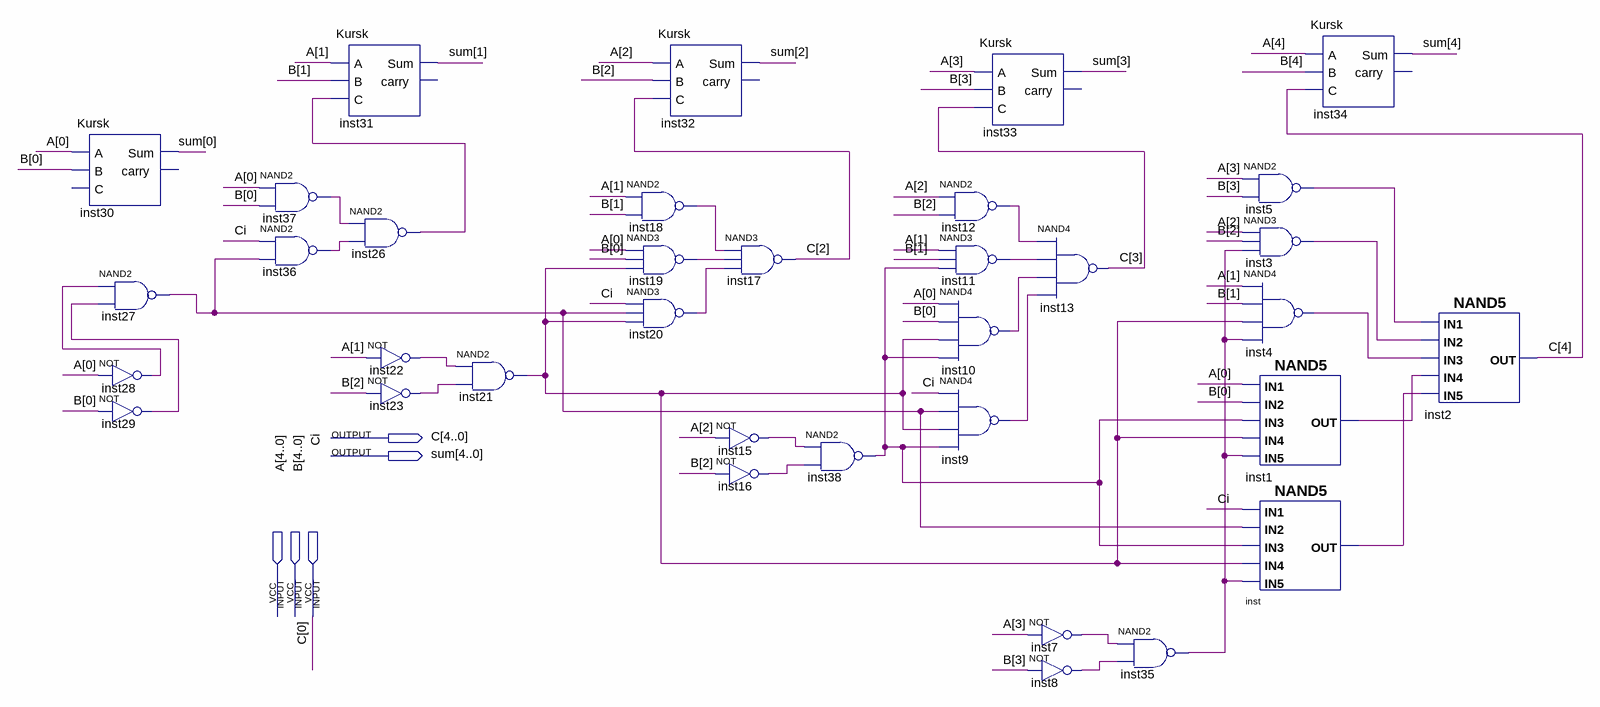
[diagram p0: schematic sheet]
// Quartus schematic paralelsum.bdf as structural Verilog: 35 symbols, 5 pins
module paralelsum (
  input  [4:0] A,
  input  [4:0] B,
  input  Ci,
  output [4:0] C,
  output [4:0] sum
);

  wire inst1_out, inst3_out, inst4_out, inst5_out, inst7_out, inst8_out, inst9_out, inst10_out, inst11_out,
       inst12_out, inst15_out, inst16_out, inst18_out, inst19_out, inst20_out, inst21_out, inst22_out,
       inst23_out, inst26_out, inst27_out, inst28_out, inst29_out, inst35_out, inst36_out, inst37_out,
       inst38_out, inst_out;

  Kursk inst30 (.A(A[0]), .B(B[0]), .Sum(sum[0]));  // open: C, carry
  nand inst27 (inst27_out, inst28_out, inst29_out);
  not inst28 (inst28_out, A[0]);
  not inst29 (inst29_out, B[0]);
  nand inst37 (inst37_out, A[0], B[0]);
  nand inst36 (inst36_out, Ci, inst27_out);
  Kursk inst31 (.A(A[1]), .B(B[1]), .C(inst26_out), .Sum(sum[1]));  // open: carry
  nand inst26 (inst26_out, inst37_out, inst36_out);
  not inst22 (inst22_out, A[1]);
  not inst23 (inst23_out, B[2]);
  nand inst21 (inst21_out, inst22_out, inst23_out);
  Kursk inst32 (.A(A[2]), .B(B[2]), .C(C[2]), .Sum(sum[2]));  // open: carry
  nand inst18 (inst18_out, A[1], B[1]);
  nand inst19 (inst19_out, A[0], B[0], inst21_out);
  nand inst20 (inst20_out, Ci, inst27_out, inst21_out);
  nand inst17 (C[2], inst18_out, inst19_out, inst20_out);
  not inst15 (inst15_out, A[2]);
  not inst16 (inst16_out, B[2]);
  nand inst38 (inst38_out, inst15_out, inst16_out);
  nand inst12 (inst12_out, A[2], B[2]);
  nand inst11 (inst11_out, A[1], B[1], inst38_out);
  nand inst10 (inst10_out, A[0], B[0], inst21_out, inst38_out);
  nand inst9 (inst9_out, Ci, inst27_out, inst21_out, inst38_out);
  Kursk inst33 (.A(A[3]), .B(B[3]), .C(C[3]), .Sum(sum[3]));  // open: carry
  nand inst13 (C[3], inst12_out, inst11_out, inst10_out, inst9_out);
  not inst7 (inst7_out, A[3]);
  not inst8 (inst8_out, B[3]);
  nand inst35 (inst35_out, inst7_out, inst8_out);
  Kursk inst34 (.A(A[4]), .B(B[4]), .C(C[4]), .Sum(sum[4]));  // open: carry
  nand inst5 (inst5_out, A[3], B[3]);
  nand inst3 (inst3_out, A[2], B[2], inst35_out);
  nand inst4 (inst4_out, A[1], B[1], inst21_out, inst35_out);
  nand inst1 (inst1_out, A[0], B[0], inst38_out, inst21_out, inst35_out);
  nand inst (inst_out, Ci, inst27_out, inst38_out, inst21_out, inst35_out);
  nand inst2 (C[4], inst5_out, inst3_out, inst4_out, inst1_out, inst_out);

  assign C[0] = Ci;
endmodule
